# Altium schematic sheet mcu-io.SchDoc: CS - MCU - I/O
size Letter; CheckedBy: J. Brinton; CompanyName: Signal Laboratories, Inc.; DrawnBy: J. Brinton; Engineer: J. Brinton; Address1: 3479 Edison Way; Address2: Menlo Park CA 94025; Address3: +1 (877) 778-8435; Address4: siglabs.com; Revision: 3; SheetNumber: 18; SheetTotal: 47
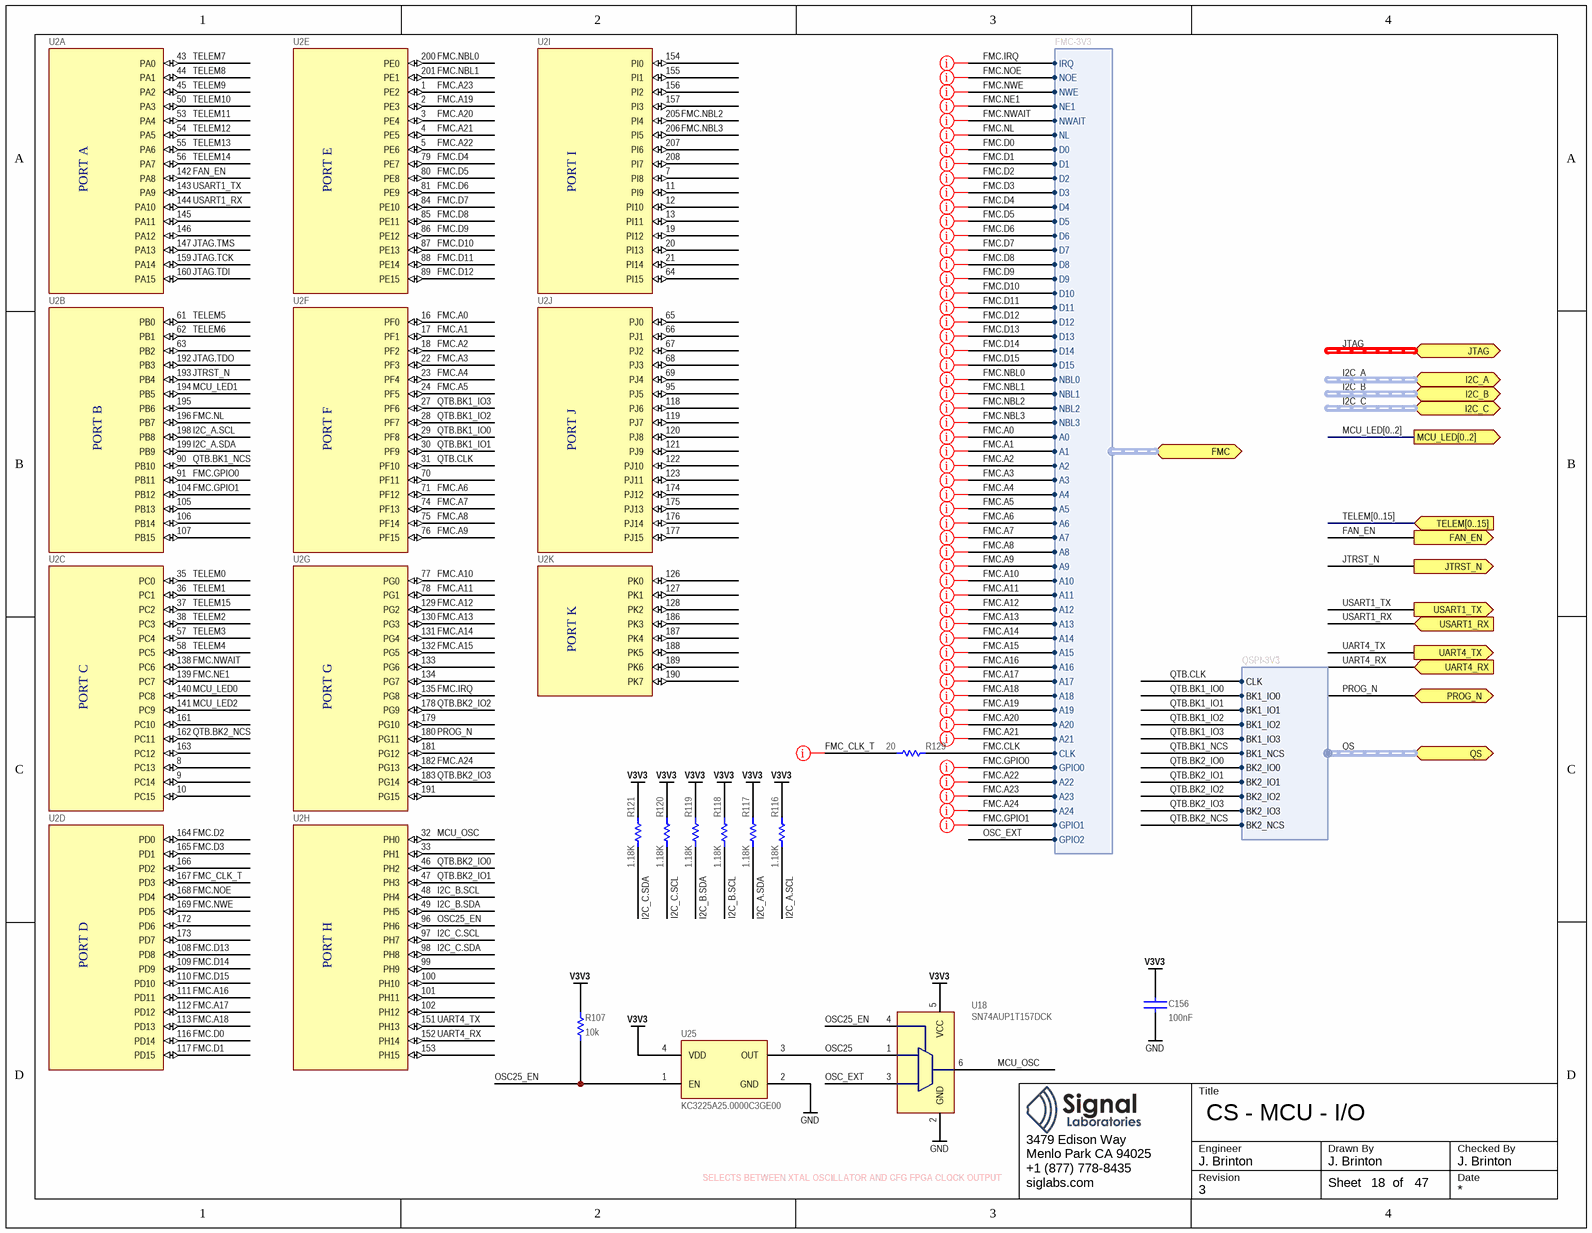
[diagram p0: mcu-io.SchDoc]

## Parts
C156  value 100nF  [CAPC100X50X55L25N]  (hidden comment: GCM155R71H104KE02)
R107  value 10k  [RESC1005X40N]  (hidden comment: ERJ-2RKF1002X)
R116  value 1.18K  [RESC1005X40N]  (hidden comment: RC0402FR-071K18L)
R117  value 1.18K  [RESC1005X40N]  (hidden comment: RC0402FR-071K18L)
R118  value 1.18K  [RESC1005X40N]  (hidden comment: RC0402FR-071K18L)
R119  value 1.18K  [RESC1005X40N]  (hidden comment: RC0402FR-071K18L)
R120  value 1.18K  [RESC1005X40N]  (hidden comment: RC0402FR-071K18L)
R121  value 1.18K  [RESC1005X40N]  (hidden comment: RC0402FR-071K18L)
R129  value 20  [RESC1005X40N]  (hidden comment: ERJ-2RKF20R0X)
U2  STM32F779BI  [LQFP208]  (value not drawn)  (parts A,B,C,D,E,F,G,H,I,J,K of 12)
U18  SN74AUP1T157DCK  [SOT363]
U25  KC3225A25.0000C3GE00  [OSCCC320X250X80L75X100N]

## Ports
FAN_EN (out), FMC (harness FMC-3V3), I2C_A (harness I2C-3V3), I2C_B (harness I2C-3V3), I2C_C (harness I2C-3V3), JTAG (harness JTAG-3V3), JTRST_N (out), MCU_LED[0..2] (out), PROG_N (bidir), QS (harness QSPI-3V3), TELEM[0..15] (in), UART4_RX (in), UART4_TX (out), USART1_RX (in), USART1_TX (out)

## Harnesses
QSPI-3V3: CLK, BK1_IO0, BK1_IO1, BK1_IO2, BK1_IO3, BK1_NCS, BK2_IO0, BK2_IO1, BK2_IO2, BK2_IO3, BK2_NCS
FMC-3V3: IRQ, NOE, NWE, NE1, NWAIT, NL, D0, D1, D2, D3, D4, D5, D6, D7, D8, D9, D10, D11, D12, D13, D14, D15, NBL0, NBL1, NBL2, NBL3, A0, A1, A2, A3, A4, A5, A6, A7, A8, A9, A10, A11, A12, A13, A14, A15, A16, A17, A18, A19, A20, A21, CLK, GPIO0, A22, A23, A24, GPIO1, GPIO2

## Nets
GND: C156.1 U18.2(GND) U25.2(GND)
V3V3: C156.2 R107.2 R116.2 R117.2 R118.2 R119.2 R120.2 R121.2 U18.5(VCC) U25.4(VDD)
FAN_EN: U2.142(PA8) ; port FAN_EN
FMC.A0: U2.16(PF0) ; port FMC.A0
FMC.A1: U2.17(PF1) ; port FMC.A1
FMC.A2: U2.18(PF2) ; port FMC.A2
FMC.A3: U2.22(PF3) ; port FMC.A3
FMC.A4: U2.23(PF4) ; port FMC.A4
FMC.A5: U2.24(PF5) ; port FMC.A5
FMC.A6: U2.71(PF12) ; port FMC.A6
FMC.A7: U2.74(PF13) ; port FMC.A7
FMC.A8: U2.75(PF14) ; port FMC.A8
FMC.A9: U2.76(PF15) ; port FMC.A9
FMC.A10: U2.77(PG0) ; port FMC.A10
FMC.A11: U2.78(PG1) ; port FMC.A11
FMC.A12: U2.129(PG2) ; port FMC.A12
FMC.A13: U2.130(PG3) ; port FMC.A13
FMC.A14: U2.131(PG4) ; port FMC.A14
FMC.A15: U2.132(PG5) ; port FMC.A15
FMC.A16: U2.111(PD11) ; port FMC.A16
FMC.A17: U2.112(PD12) ; port FMC.A17
FMC.A18: U2.113(PD13) ; port FMC.A18
FMC.A19: U2.2(PE3) ; port FMC.A19
FMC.A20: U2.3(PE4) ; port FMC.A20
FMC.A21: U2.4(PE5) ; port FMC.A21
FMC.A22: U2.5(PE6) ; port FMC.A22
FMC.A23: U2.1(PE2) ; port FMC.A23
FMC.A24: U2.182(PG13) ; port FMC.A24
FMC.CLK: R129.2 ; port FMC.CLK
FMC.D0: U2.116(PD14) ; port FMC.D0
FMC.D1: U2.117(PD15) ; port FMC.D1
FMC.D2: U2.164(PD0) ; port FMC.D2
FMC.D3: U2.165(PD1) ; port FMC.D3
FMC.D4: U2.79(PE7) ; port FMC.D4
FMC.D5: U2.80(PE8) ; port FMC.D5
FMC.D6: U2.81(PE9) ; port FMC.D6
FMC.D7: U2.84(PE10) ; port FMC.D7
FMC.D8: U2.85(PE11) ; port FMC.D8
FMC.D9: U2.86(PE12) ; port FMC.D9
FMC.D10: U2.87(PE13) ; port FMC.D10
FMC.D11: U2.88(PE14) ; port FMC.D11
FMC.D12: U2.89(PE15) ; port FMC.D12
FMC.D13: U2.108(PD8) ; port FMC.D13
FMC.D14: U2.109(PD9) ; port FMC.D14
FMC.D15: U2.110(PD10) ; port FMC.D15
FMC.GPIO0: U2.91(PB11) ; port FMC.GPIO0
FMC.GPIO1: U2.104(PB12) ; port FMC.GPIO1
FMC.IRQ: U2.135(PG8) ; port FMC.IRQ
FMC.NBL0: U2.200(PE0) ; port FMC.NBL0
FMC.NBL1: U2.201(PE1) ; port FMC.NBL1
FMC.NBL2: U2.205(PI4) ; port FMC.NBL2
FMC.NBL3: U2.206(PI5) ; port FMC.NBL3
FMC.NE1: U2.139(PC7) ; port FMC.NE1
FMC.NL: U2.196(PB7) ; port FMC.NL
FMC.NOE: U2.168(PD4) ; port FMC.NOE
FMC.NWAIT: U2.138(PC6) ; port FMC.NWAIT
FMC.NWE: U2.169(PD5) ; port FMC.NWE
FMC_CLK_T: R129.1 U2.167(PD3)
I2C_A.SCL: R116.1 U2.198(PB8)
I2C_A.SDA: R117.1 U2.199(PB9)
I2C_B.SCL: R118.1 U2.48(PH4)
I2C_B.SDA: R119.1 U2.49(PH5)
I2C_C.SCL: R120.1 U2.97(PH7)
I2C_C.SDA: R121.1 U2.98(PH8)
JTAG.TCK: U2.159(PA14)
JTAG.TDI: U2.160(PA15)
JTAG.TDO: U2.192(PB3)
JTAG.TMS: U2.147(PA13)
JTRST_N: U2.193(PB4) ; port JTRST_N
MCU_LED0: U2.140(PC8)
MCU_LED1: U2.194(PB5)
MCU_LED2: U2.141(PC9)
MCU_OSC: U2.32(PH0) U18.6(Y)
OSC25: U18.1(A) U25.3(OUT)
OSC25_EN: R107.1 U2.96(PH6) U18.4(C) U25.1(EN)
OSC_EXT: U18.3(B) ; port FMC.GPIO2
PROG_N: U2.180(PG11) ; port PROG_N
QTB.BK1_IO0: U2.29(PF8) ; port QS.BK1_IO0  [project net QS.BK1_IO0]
QTB.BK1_IO1: U2.30(PF9) ; port QS.BK1_IO1  [project net QS.BK1_IO1]
QTB.BK1_IO2: U2.28(PF7) ; port QS.BK1_IO2  [project net QS.BK1_IO2]
QTB.BK1_IO3: U2.27(PF6) ; port QS.BK1_IO3  [project net QS.BK1_IO3]
QTB.BK1_NCS: U2.90(PB10) ; port QS.BK1_NCS  [project net QS.BK1_NCS]
QTB.BK2_IO0: U2.46(PH2) ; port QS.BK2_IO0  [project net QS.BK2_IO0]
QTB.BK2_IO1: U2.47(PH3) ; port QS.BK2_IO1  [project net QS.BK2_IO1]
QTB.BK2_IO2: U2.178(PG9) ; port QS.BK2_IO2  [project net QS.BK2_IO2]
QTB.BK2_IO3: U2.183(PG14) ; port QS.BK2_IO3  [project net QS.BK2_IO3]
QTB.BK2_NCS: U2.162(PC11) ; port QS.BK2_NCS  [project net QS.BK2_NCS]
QTB.CLK: U2.31(PF10) ; port QS.CLK  [project net QS.CLK]
TELEM0: U2.35(PC0)
TELEM1: U2.36(PC1)
TELEM2: U2.38(PC3)
TELEM3: U2.57(PC4)
TELEM4: U2.58(PC5)
TELEM5: U2.61(PB0)
TELEM6: U2.62(PB1)
TELEM7: U2.43(PA0)
TELEM8: U2.44(PA1)
TELEM9: U2.45(PA2)
TELEM10: U2.50(PA3)
TELEM11: U2.53(PA4)
TELEM12: U2.54(PA5)
TELEM13: U2.55(PA6)
TELEM14: U2.56(PA7)
TELEM15: U2.37(PC2)
UART4_RX: U2.152(PH14) ; port UART4_RX
UART4_TX: U2.151(PH13) ; port UART4_TX
USART1_RX: U2.144(PA10) ; port USART1_RX
USART1_TX: U2.143(PA9) ; port USART1_TX

Not connected (* = marked no-connect by the designer): U2 7(PI8) 8(PC13) 9(PC14) 10(PC15) 11(PI9) 12(PI10) 13(PI11) 19(PI12) 20(PI13) 21(PI14) 33(PH1) 63(PB2) 64(PI15) 65(PJ0) 66(PJ1) 67(PJ2) 68(PJ3) 69(PJ4) 70(PF11) 95(PJ5) 99(PH9) 100(PH10) 101(PH11) 102(PH12) 105(PB13) 106(PB14) 107(PB15) 118(PJ6) 119(PJ7) 120(PJ8) 121(PJ9) 122(PJ10) 123(PJ11) 126(PK0) 127(PK1) 128(PK2) 133(PG6) 134(PG7) 145(PA11) 146(PA12) 153(PH15) 154(PI0) 155(PI1) 156(PI2) 157(PI3) 161(PC10) 163(PC12) 166(PD2) 172(PD6) 173(PD7) 174(PJ12) 175(PJ13) 176(PJ14) 177(PJ15) 179(PG10) 181(PG12) 186(PK3) 187(PK4) 188(PK5) 189(PK6) 190(PK7) 191(PG15) 195(PB6) 207(PI6) 208(PI7)

## Buses and harness runs
bus MCU_LED[0..2] = port MCU_LED[0..2]
bus TELEM[0..15] = port TELEM[0..15]
harness I2C_A = port I2C_A
harness I2C_B = port I2C_B
harness I2C_C = port I2C_C
harness JTAG = port JTAG
harness QS = port QS

## Layout directives
net class z50: FMC.A0, FMC.A1, FMC.A2, FMC.A3, FMC.A4, FMC.A5, FMC.A6, FMC.A7, FMC.A8, FMC.A9, FMC.A10, FMC.A11, FMC.A12, FMC.A13, FMC.A14, FMC.A15, FMC.A16, FMC.A17, FMC.A18, FMC.A19, FMC.A20, FMC.A21, FMC.A22, FMC.A23, FMC.A24, FMC.D0, FMC.D1, FMC.D2, FMC.D3, FMC.D4, FMC.D5, FMC.D6, FMC.D7, FMC.D8, FMC.D9, FMC.D10, FMC.D11, FMC.D12, FMC.D13, FMC.D14, FMC.D15, FMC.GPIO0, FMC.GPIO1, FMC.IRQ, FMC.NBL0, FMC.NBL1, FMC.NBL2, FMC.NBL3, FMC.NE1, FMC.NL, FMC.NOE, FMC.NWAIT, FMC.NWE, FMC_CLK_T

## Notes on the sheet
- SELECTS BETWEEN XTAL OSCILLATOR AND CFG FPGA CLOCK OUTPUT
- Title
- Engineer
- Revision
- Drawn By
- Checked By
- Date
- Sheet
- of
- (in symbol STM32F746BGT6, part A) PORT A
- (in symbol STM32F746BGT6, part B) PORT B
- (in symbol STM32F746BGT6, part C) PORT C
- (in symbol STM32F746BGT6, part D) PORT D
- (in symbol STM32F746BGT6, part E) PORT E
- (in symbol STM32F746BGT6, part F) PORT F
- (in symbol STM32F746BGT6, part G) PORT G
- (in symbol STM32F746BGT6, part H) PORT H
- (in symbol STM32F746BGT6, part I) PORT I
- (in symbol STM32F746BGT6, part J) PORT J
- (in symbol STM32F746BGT6, part K) PORT K

## Library data of the parts
C156 = CAP: Ceramic Capacitor 100nF ±10% 50V X7R 0402; Manufacturer: Murata; Tr: -55:125; Voltage: 50V; Manufacturer P/N: GCM155R71H104KE02; Tolerance: ±10%; Footprint: *; Package: 0402
R107 = RES: Thick Film Resistor 10k ±1% 0.1W 50V 0402; Manufacturer: Panasonic; Tcr: ±100; Tr: -55:155; Voltage: 50; Power: 0.1; Manufacturer P/N: ERJ-2RKF1002X; Tolerance: ±1%; Alternatives: *; Footprint: *; Package: 0402
R116-R121 = RES 0402: Thick Film Resistor 1.18k ±1% 0402; Manufacturer: Yageo; Tr: -55:155; Package: 0402; Manufacturer P/N: RC0402FR-071K18L; Tolerance: ±1%
R129 = RES: Thick Film Resistor 20 ±1% 0.1W 75V 0402; Manufacturer: Panasonic; Tcr: ±100; Tr: -55:155; Voltage: 75; Power: 0.1; Tolerance: ±1%; Manufacturer P/N: ERJ-2RKF20R0X; Alternatives: *; Footprint: *; Package: 0402
U2 = STM32F746BGT6: STM32 Microcontroller; Manufacturer: ST Microelectronics; Manufacturer P/N: STM32F779BI
U18 = SN74AUP1T157DCK: Buffer Multiplexer; Manufacturer: Texas Instruments; Manufacturer P/N: SN74AUP1T157DCK
U25 = OSC_25M_NZ2520SB: Oscillator 25.00Mhz, -+50PPM, 3.3V; Manufacturer: Kyocera; Manufacturer P/N: KC3225A25.0000C3GE00